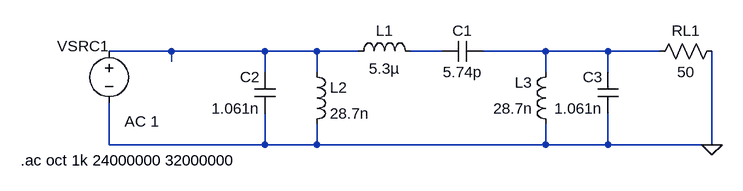
[diagram p0: schematic Draft1.asc]
Draft1.asc, the LTspice schematic file:
Version 4
SHEET 1 976 680
WIRE 128 272 32 272
WIRE 272 272 128 272
WIRE 352 272 272 272
WIRE 416 272 352 272
WIRE 544 272 496 272
WIRE 704 272 608 272
WIRE 800 272 704 272
WIRE 880 272 800 272
WIRE 128 288 128 272
WIRE 272 304 272 272
WIRE 352 304 352 272
WIRE 704 304 704 272
WIRE 800 304 800 272
WIRE 32 416 32 352
WIRE 272 416 272 368
WIRE 272 416 32 416
WIRE 352 416 352 384
WIRE 352 416 272 416
WIRE 704 416 704 384
WIRE 704 416 352 416
WIRE 800 416 800 368
WIRE 800 416 704 416
WIRE 960 416 960 272
WIRE 960 416 800 416
FLAG 960 416 0
SYMBOL voltage 32 256 R0
WINDOW 0 -80 8 Left 2
WINDOW 123 24 124 Left 2
WINDOW 39 24 152 Left 2
SYMATTR InstName VSRC1
SYMATTR Value2 AC 1
SYMATTR Value ""
SYMBOL res 976 256 R90
WINDOW 0 0 56 VBottom 2
WINDOW 3 32 56 VTop 2
SYMATTR InstName RL1
SYMATTR Value 50
SYMBOL cap 608 256 R90
WINDOW 0 0 32 VBottom 2
WINDOW 3 32 32 VTop 2
SYMATTR InstName C1
SYMATTR Value 5.74p
SYMBOL cap 288 368 R180
WINDOW 0 24 56 Left 2
WINDOW 3 24 8 Left 2
SYMATTR InstName C2
SYMATTR Value 1.061n
SYMBOL cap 816 368 R180
WINDOW 0 24 56 Left 2
WINDOW 3 24 8 Left 2
SYMATTR InstName C3
SYMATTR Value 1.061n
SYMBOL ind 400 288 R270
WINDOW 0 32 56 VTop 2
WINDOW 3 5 56 VBottom 2
SYMATTR InstName L1
SYMATTR Value 5.3µ
SYMBOL ind 336 288 R0
SYMATTR InstName L2
SYMATTR Value 28.7n
SYMBOL ind 720 400 R180
WINDOW 0 36 80 Left 2
WINDOW 3 36 40 Left 2
SYMATTR InstName L3
SYMATTR Value 28.7n
TEXT -104 440 Left 2 !.ac oct 1k 24000000 32000000

The netlist it stands for:
* Draft1.asc
VSRC1 N001 0 AC 1
RL1 0 N003 50
C1 N003 N002 5.74p
C2 0 N001 1.061n
C3 0 N003 1.061n
L1 N001 N002 5.3µ
L2 N001 0 28.7n
L3 0 N003 28.7n
.ac oct 1k 24000000 32000000
.backanno
.end